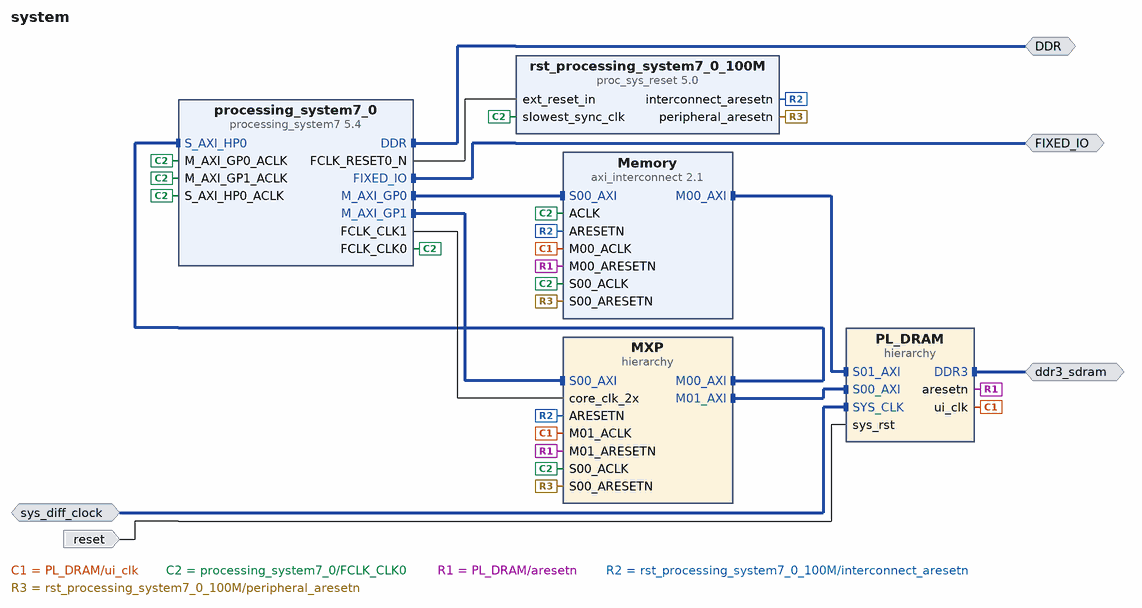
[diagram p0: block diagram of the top level]
# Vivado block design system, Vivado 2014.2
create_bd_design system

create_bd_intf_port -mode Master -vlnv xilinx.com:interface:ddrx_rtl:1.0 DDR
create_bd_intf_port -mode Master -vlnv xilinx.com:display_processing_system7:fixedio_rtl:1.0 FIXED_IO
create_bd_intf_port -mode Master -vlnv xilinx.com:interface:ddrx_rtl:1.0 ddr3_sdram
create_bd_intf_port -mode Slave -vlnv xilinx.com:interface:diff_clock_rtl:1.0 sys_diff_clock
create_bd_port -dir I -type rst reset
set_property -dict {CONFIG.POLARITY ACTIVE_HIGH} [get_bd_ports reset]

create_bd_cell -type hier MXP
create_bd_cell -type ip -vlnv xilinx.com:ip:axi_interconnect:2.1 Memory
set_property -dict {CONFIG.NUM_MI 1} [get_bd_cells Memory]
create_bd_cell -type hier PL_DRAM
create_bd_cell -type ip -vlnv xilinx.com:ip:processing_system7:5.4 processing_system7_0
set_property -dict [list \
  CONFIG.PCW_FPGA0_PERIPHERAL_FREQMHZ 100 \
  CONFIG.PCW_FPGA1_PERIPHERAL_FREQMHZ 200 \
  CONFIG.PCW_USE_M_AXI_GP1 1 \
  CONFIG.PCW_USE_S_AXI_HP0 1 \
  CONFIG.PCW_EN_CLK1_PORT 1 \
  CONFIG.preset {ZC706*} \
] [get_bd_cells processing_system7_0]
create_bd_cell -type ip -vlnv xilinx.com:ip:proc_sys_reset:5.0 rst_processing_system7_0_100M

# ---- hierarchy /MXP ----
current_bd_instance /MXP
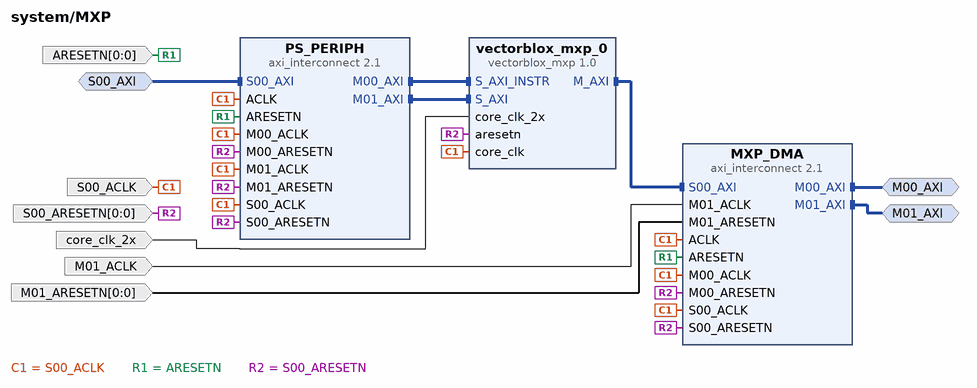
[diagram p1: block diagram inside /MXP]
create_bd_intf_pin -mode Master -vlnv xilinx.com:interface:aximm_rtl:1.0 M00_AXI
create_bd_intf_pin -mode Master -vlnv xilinx.com:interface:aximm_rtl:1.0 M01_AXI
create_bd_intf_pin -mode Slave -vlnv xilinx.com:interface:aximm_rtl:1.0 S00_AXI
create_bd_pin -dir I -from 0 -to 0 -type rst ARESETN
create_bd_pin -dir I -type clk M01_ACLK
create_bd_pin -dir I -from 0 -to 0 -type rst M01_ARESETN
create_bd_pin -dir I -type clk S00_ACLK
create_bd_pin -dir I -from 0 -to 0 -type rst S00_ARESETN
create_bd_pin -dir I core_clk_2x

create_bd_cell -type ip -vlnv xilinx.com:ip:axi_interconnect:2.1 MXP_DMA
set_property -dict {CONFIG.NUM_MI 2} [get_bd_cells MXP_DMA]
create_bd_cell -type ip -vlnv xilinx.com:ip:axi_interconnect:2.1 PS_PERIPH
set_property -dict {CONFIG.NUM_MI 2} [get_bd_cells PS_PERIPH]
create_bd_cell -type ip -vlnv vectorblox.com:ip:vectorblox_mxp:1.0 vectorblox_mxp_0
set_property -dict [list \
  CONFIG.VECTOR_LANES 8 \
  CONFIG.MEMORY_WIDTH_LANES 8 \
  CONFIG.C_INSTR_PORT_TYPE 2 \
  CONFIG.C_M_AXI_PROTOCOL AXI4 \
] [get_bd_cells vectorblox_mxp_0]

# ---- hierarchy /PL_DRAM ----
current_bd_instance /PL_DRAM
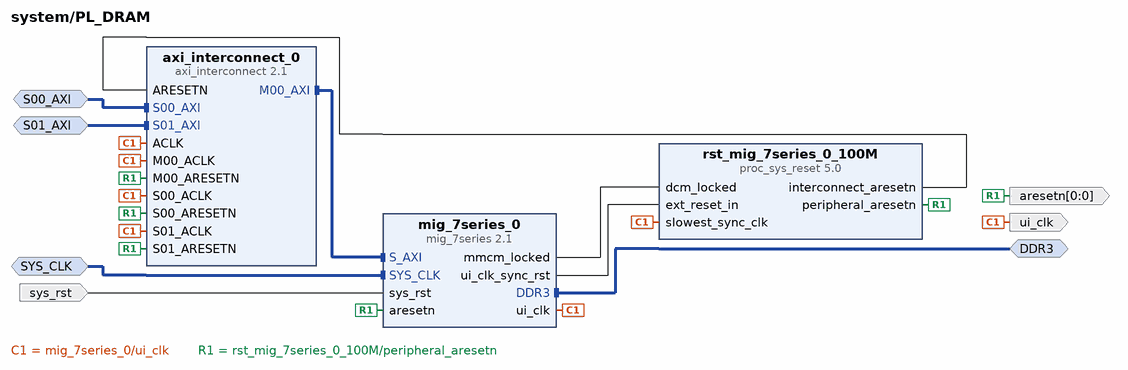
[diagram p2: block diagram inside /PL_DRAM]
create_bd_intf_pin -mode Master -vlnv xilinx.com:interface:ddrx_rtl:1.0 DDR3
create_bd_intf_pin -mode Slave -vlnv xilinx.com:interface:aximm_rtl:1.0 S00_AXI
create_bd_intf_pin -mode Slave -vlnv xilinx.com:interface:aximm_rtl:1.0 S01_AXI
create_bd_intf_pin -mode Slave -vlnv xilinx.com:interface:diff_clock_rtl:1.0 SYS_CLK
create_bd_pin -dir O -from 0 -to 0 -type rst aresetn
create_bd_pin -dir I -type rst sys_rst
create_bd_pin -dir O -type clk ui_clk

create_bd_cell -type ip -vlnv xilinx.com:ip:axi_interconnect:2.1 axi_interconnect_0
set_property -dict {CONFIG.NUM_SI 2 CONFIG.NUM_MI 1} [get_bd_cells axi_interconnect_0]
create_bd_cell -type ip -vlnv xilinx.com:ip:mig_7series:2.1 mig_7series_0
set_property -dict {CONFIG.RESET_BOARD_INTERFACE reset CONFIG.BOARD_MIG_PARAM ddr3_sdram} [get_bd_cells mig_7series_0]
create_bd_cell -type ip -vlnv xilinx.com:ip:proc_sys_reset:5.0 rst_mig_7series_0_100M

# ---- connections ----

current_bd_instance /MXP
connect_bd_intf_net [get_bd_intf_pins PS_PERIPH/M00_AXI] [get_bd_intf_pins vectorblox_mxp_0/S_AXI_INSTR]
connect_bd_intf_net [get_bd_intf_pins PS_PERIPH/M01_AXI] [get_bd_intf_pins vectorblox_mxp_0/S_AXI]
connect_bd_intf_net [get_bd_intf_pins MXP_DMA/S00_AXI] [get_bd_intf_pins vectorblox_mxp_0/M_AXI]
connect_bd_intf_net -intf_net axi_mem_intercon_M00_AXI [get_bd_intf_pins M00_AXI] [get_bd_intf_pins MXP_DMA/M00_AXI]
connect_bd_intf_net -intf_net S00_AXI_1 [get_bd_intf_pins M01_AXI] [get_bd_intf_pins MXP_DMA/M01_AXI]
connect_bd_intf_net [get_bd_intf_pins S00_AXI] [get_bd_intf_pins PS_PERIPH/S00_AXI]
connect_bd_net -net mig_7series_0_ui_clk [get_bd_pins M01_ACLK] [get_bd_pins MXP_DMA/M01_ACLK]
connect_bd_net -net processing_system7_0_FCLK_CLK0 [get_bd_pins S00_ACLK] \
  [get_bd_pins MXP_DMA/ACLK] [get_bd_pins MXP_DMA/M00_ACLK] [get_bd_pins MXP_DMA/S00_ACLK] [get_bd_pins PS_PERIPH/ACLK] \
  [get_bd_pins PS_PERIPH/M00_ACLK] [get_bd_pins PS_PERIPH/M01_ACLK] [get_bd_pins PS_PERIPH/S00_ACLK] \
  [get_bd_pins vectorblox_mxp_0/core_clk]
connect_bd_net -net processing_system7_0_FCLK_CLK1 [get_bd_pins core_clk_2x] [get_bd_pins vectorblox_mxp_0/core_clk_2x]
connect_bd_net -net rst_mig_7series_0_100M_peripheral_aresetn [get_bd_pins M01_ARESETN] [get_bd_pins MXP_DMA/M01_ARESETN]
connect_bd_net -net rst_processing_system7_0_100M_interconnect_aresetn [get_bd_pins ARESETN] \
  [get_bd_pins MXP_DMA/ARESETN] [get_bd_pins PS_PERIPH/ARESETN]
connect_bd_net -net rst_processing_system7_0_100M_peripheral_aresetn [get_bd_pins S00_ARESETN] \
  [get_bd_pins MXP_DMA/M00_ARESETN] [get_bd_pins MXP_DMA/S00_ARESETN] [get_bd_pins PS_PERIPH/M00_ARESETN] \
  [get_bd_pins PS_PERIPH/M01_ARESETN] [get_bd_pins PS_PERIPH/S00_ARESETN] [get_bd_pins vectorblox_mxp_0/aresetn]

current_bd_instance /PL_DRAM
connect_bd_intf_net [get_bd_intf_pins axi_interconnect_0/M00_AXI] [get_bd_intf_pins mig_7series_0/S_AXI]
connect_bd_intf_net [get_bd_intf_pins DDR3] [get_bd_intf_pins mig_7series_0/DDR3]
connect_bd_intf_net [get_bd_intf_pins S00_AXI] [get_bd_intf_pins axi_interconnect_0/S00_AXI]
connect_bd_intf_net -intf_net Memory_M00_AXI [get_bd_intf_pins S01_AXI] [get_bd_intf_pins axi_interconnect_0/S01_AXI]
connect_bd_intf_net -intf_net sys_diff_clock_1 [get_bd_intf_pins SYS_CLK] [get_bd_intf_pins mig_7series_0/SYS_CLK]
connect_bd_net -net ARESETN_1 [get_bd_pins rst_mig_7series_0_100M/interconnect_aresetn] [get_bd_pins axi_interconnect_0/ARESETN]
connect_bd_net [get_bd_pins mig_7series_0/mmcm_locked] [get_bd_pins rst_mig_7series_0_100M/dcm_locked]
connect_bd_net [get_bd_pins mig_7series_0/ui_clk] \
  [get_bd_pins ui_clk] [get_bd_pins axi_interconnect_0/ACLK] [get_bd_pins axi_interconnect_0/M00_ACLK] \
  [get_bd_pins axi_interconnect_0/S00_ACLK] [get_bd_pins axi_interconnect_0/S01_ACLK] \
  [get_bd_pins rst_mig_7series_0_100M/slowest_sync_clk]
connect_bd_net [get_bd_pins mig_7series_0/ui_clk_sync_rst] [get_bd_pins rst_mig_7series_0_100M/ext_reset_in]
connect_bd_net -net reset_1 [get_bd_pins sys_rst] [get_bd_pins mig_7series_0/sys_rst]
connect_bd_net [get_bd_pins rst_mig_7series_0_100M/peripheral_aresetn] \
  [get_bd_pins aresetn] [get_bd_pins axi_interconnect_0/M00_ARESETN] [get_bd_pins axi_interconnect_0/S00_ARESETN] \
  [get_bd_pins axi_interconnect_0/S01_ARESETN] [get_bd_pins mig_7series_0/aresetn]

current_bd_instance /
connect_bd_intf_net [get_bd_intf_pins Memory/M00_AXI] [get_bd_intf_pins PL_DRAM/S01_AXI]
connect_bd_intf_net [get_bd_intf_pins MXP/M01_AXI] [get_bd_intf_pins PL_DRAM/S00_AXI]
connect_bd_intf_net -intf_net axi_mem_intercon_M00_AXI [get_bd_intf_pins MXP/M00_AXI] [get_bd_intf_pins processing_system7_0/S_AXI_HP0]
connect_bd_intf_net [get_bd_intf_pins Memory/S00_AXI] [get_bd_intf_pins processing_system7_0/M_AXI_GP0]
connect_bd_intf_net [get_bd_intf_pins MXP/S00_AXI] [get_bd_intf_pins processing_system7_0/M_AXI_GP1]
connect_bd_intf_net [get_bd_intf_ports DDR] [get_bd_intf_pins processing_system7_0/DDR]
connect_bd_intf_net [get_bd_intf_ports FIXED_IO] [get_bd_intf_pins processing_system7_0/FIXED_IO]
connect_bd_intf_net -intf_net mig_7series_0_DDR3 [get_bd_intf_ports ddr3_sdram] [get_bd_intf_pins PL_DRAM/DDR3]
connect_bd_intf_net [get_bd_intf_ports sys_diff_clock] [get_bd_intf_pins PL_DRAM/SYS_CLK]
connect_bd_net -net mig_7series_0_ui_clk [get_bd_pins PL_DRAM/ui_clk] [get_bd_pins MXP/M01_ACLK] [get_bd_pins Memory/M00_ACLK]
connect_bd_net [get_bd_pins processing_system7_0/FCLK_CLK0] \
  [get_bd_pins MXP/S00_ACLK] [get_bd_pins Memory/ACLK] [get_bd_pins Memory/S00_ACLK] \
  [get_bd_pins processing_system7_0/M_AXI_GP0_ACLK] [get_bd_pins processing_system7_0/M_AXI_GP1_ACLK] \
  [get_bd_pins processing_system7_0/S_AXI_HP0_ACLK] [get_bd_pins rst_processing_system7_0_100M/slowest_sync_clk]
connect_bd_net [get_bd_pins processing_system7_0/FCLK_CLK1] [get_bd_pins MXP/core_clk_2x]
connect_bd_net [get_bd_pins processing_system7_0/FCLK_RESET0_N] [get_bd_pins rst_processing_system7_0_100M/ext_reset_in]
connect_bd_net [get_bd_ports reset] [get_bd_pins PL_DRAM/sys_rst]
connect_bd_net -net rst_mig_7series_0_100M_peripheral_aresetn [get_bd_pins PL_DRAM/aresetn] \
  [get_bd_pins MXP/M01_ARESETN] [get_bd_pins Memory/M00_ARESETN]
connect_bd_net [get_bd_pins rst_processing_system7_0_100M/interconnect_aresetn] [get_bd_pins MXP/ARESETN] [get_bd_pins Memory/ARESETN]
connect_bd_net [get_bd_pins rst_processing_system7_0_100M/peripheral_aresetn] [get_bd_pins MXP/S00_ARESETN] [get_bd_pins Memory/S00_ARESETN]

# ---- address map ----
assign_bd_address -offset 0x00000000 -range 1G -target_address_space [get_bd_addr_spaces MXP/vectorblox_mxp_0/M_AXI] [get_bd_addr_segs processing_system7_0/S_AXI_HP0/HP0_DDR_LOWOCM]
assign_bd_address -offset 0x40000000 -range 1G -target_address_space [get_bd_addr_spaces MXP/vectorblox_mxp_0/M_AXI] [get_bd_addr_segs PL_DRAM/mig_7series_0/memmap/memaddr]
assign_bd_address -offset 0x40000000 -range 1G -target_address_space [get_bd_addr_spaces processing_system7_0/Data] [get_bd_addr_segs PL_DRAM/mig_7series_0/memmap/memaddr]
assign_bd_address -offset 0x83C00000 -range 64K -target_address_space [get_bd_addr_spaces processing_system7_0/Data] [get_bd_addr_segs MXP/vectorblox_mxp_0/S_AXI_INSTR/INSTR_PORT]
assign_bd_address -offset 0x8AA00000 -range 64K -target_address_space [get_bd_addr_spaces processing_system7_0/Data] [get_bd_addr_segs MXP/vectorblox_mxp_0/S_AXI/SCRATCHPAD]

validate_bd_design
save_bd_design
